# Altium schematic sheet PI_INTERFACE.SchDoc: Laser PCB
size A3; DrawnBy: James Singleton; Organization: TMC Technology Ltd.; DocumentNumber: 6; Revision: A; SheetNumber: 6; SheetTotal: 18; Drawn Date: 22/12/2020
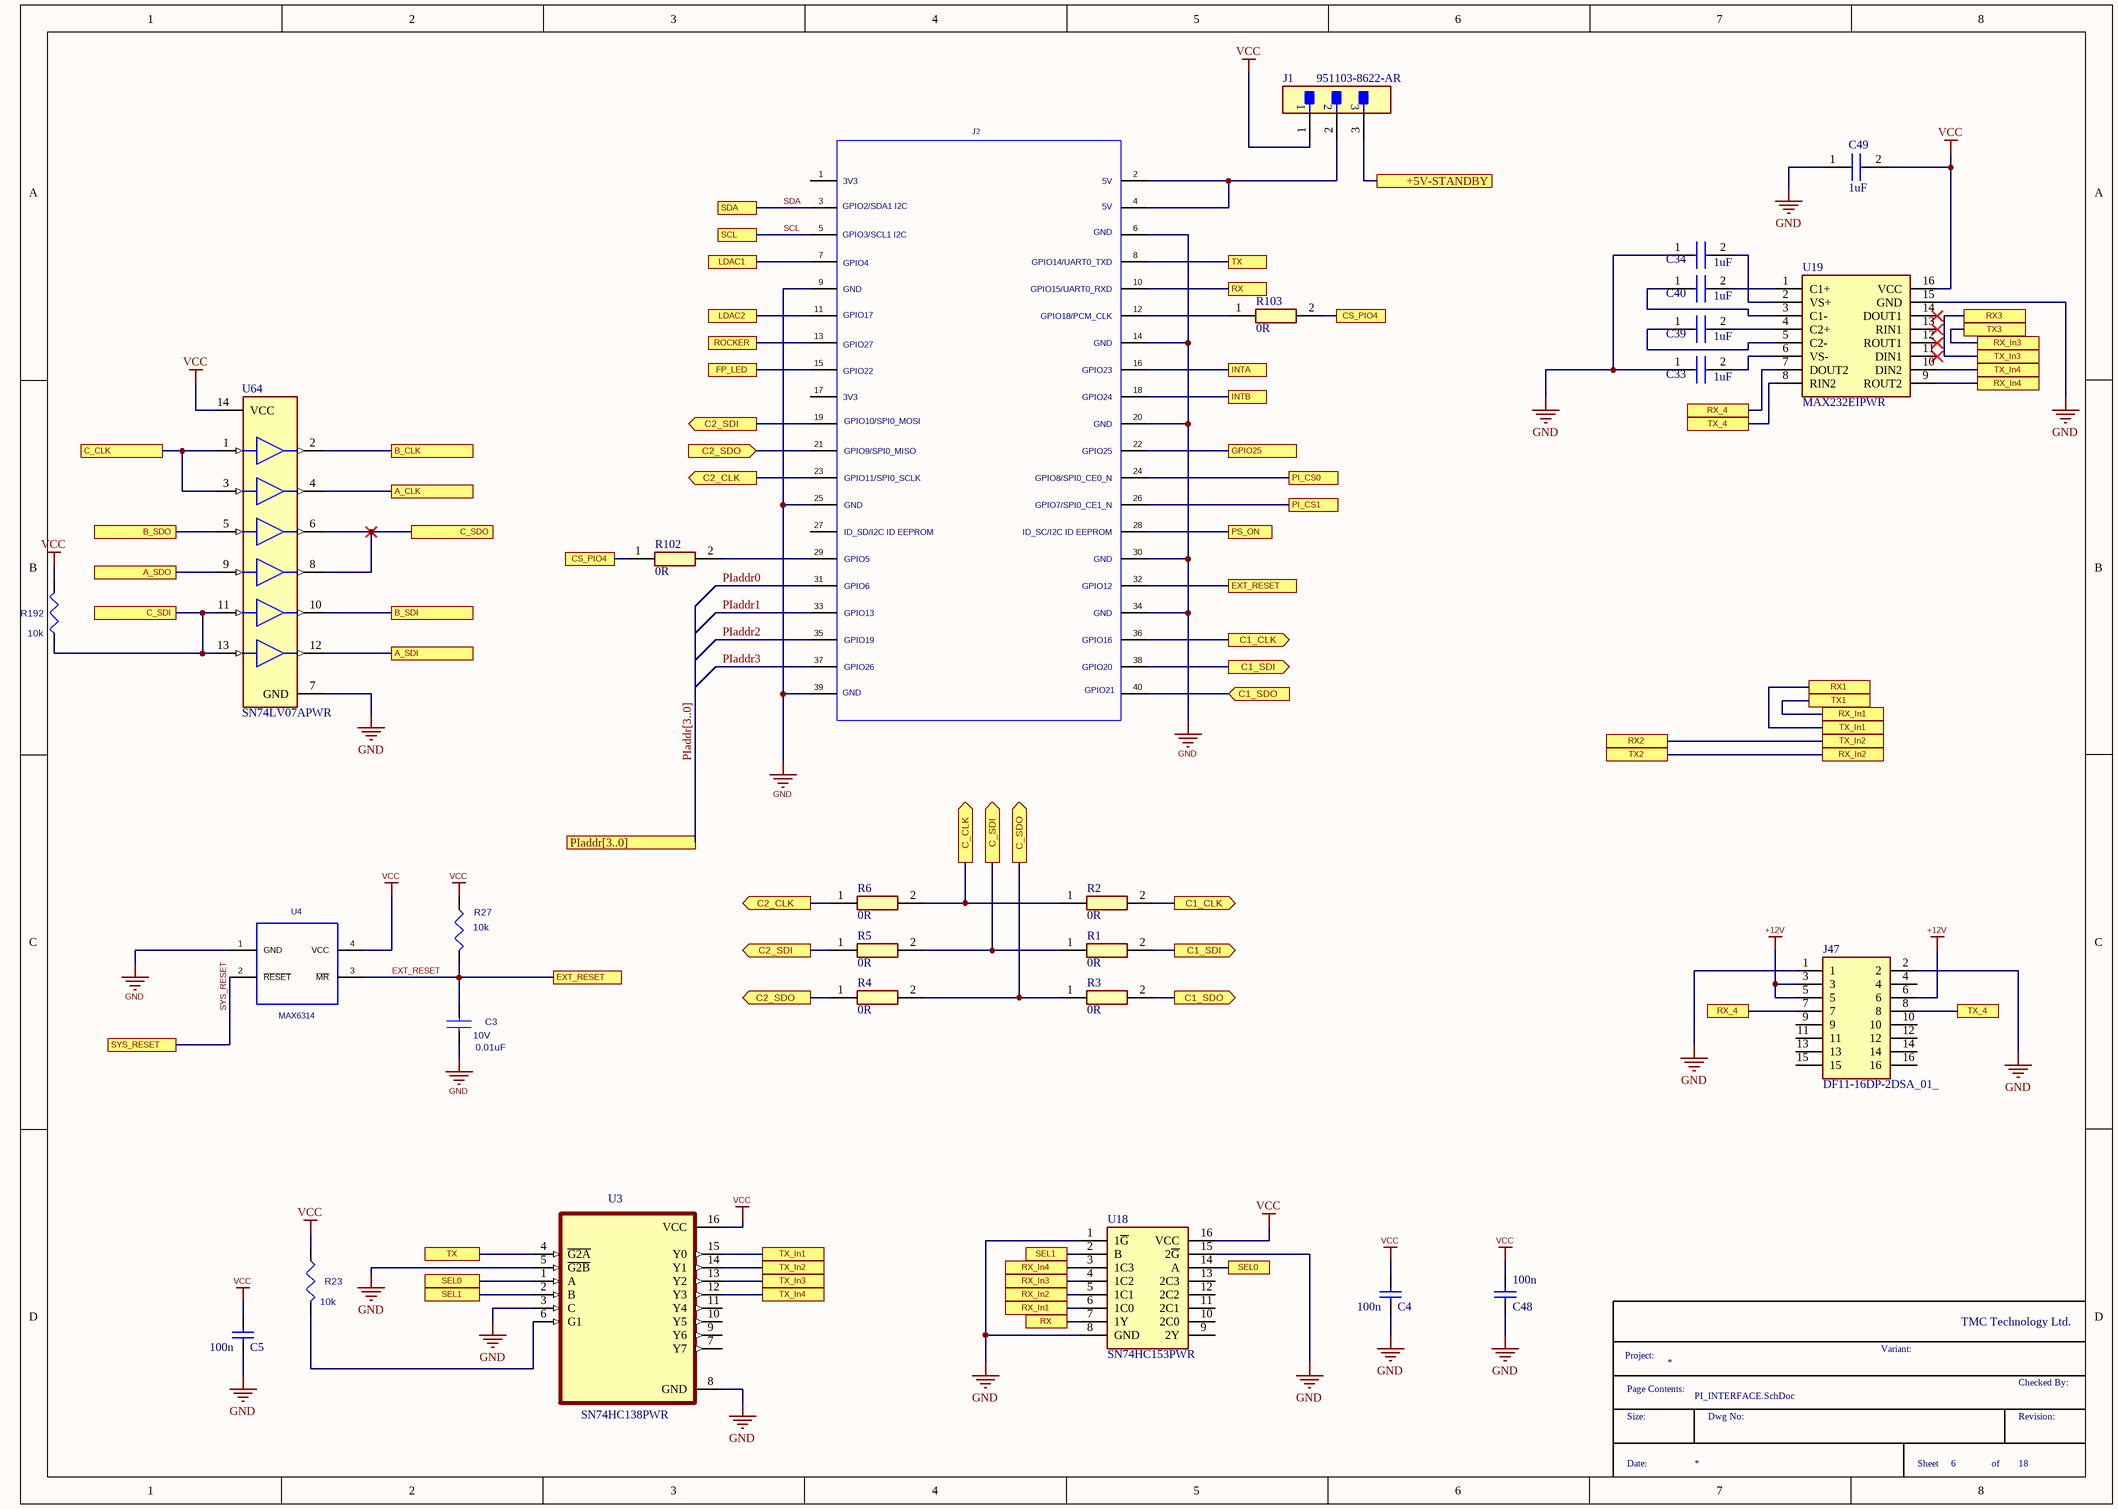
[diagram p0: PI_INTERFACE.SchDoc]

## Parts
C3  value 0.01uF  Rated_Voltage: 10V  [CC0603N]  (hidden comment: CAP)
C4  100n  [CAPC1608X90X35LL15T15]
C5  100n  [CAPC1608X90X35LL15T15]
C33  1uF  [CAPC1608X95N]
C34  1uF  [CAPC1608X95N]
C39  1uF  [CAPC1608X95N]
C40  1uF  [CAPC1608X95N]
C48  100n  [CAPC1608X90X35LL15T15]
C49  1uF  [CAPC1608X95N]
J1  951103-8622-AR  [FP-951103-8622-AR-MFG]
J2  RPI_PLUG  [HDRV40W64P254_2X20_5080X483X878P]  (value not drawn)
J47  DF11-16DP-2DSA_01_  [DF1116DP2DSA01]
R1  0R  [RESC1608X55N]
R2  0R  [RESC1608X55N]
R3  0R  [RESC1608X55N]
R4  0R  [RESC1608X55N]
R5  0R  [RESC1608X55N]
R6  0R  [RESC1608X55N]
R23  value 10k  [CR0603N]  (hidden comment: RES)
R27  value 10k  [CR0603N]  (hidden comment: RES)
R102  value 0R  [RESC1608X55N]  (hidden comment: RC0603FR-070RL)
R103  value 0R  [RESC1608X55N]  (hidden comment: RC0603FR-070RL)
R192  value 10k  [CR0603N]  (hidden comment: RES)
U3  SN74HC138PWR  [SOP65P640X120-16N]
U4  MAX6314  [SOT190P230X110-4N]
U18  SN74HC153PWR  [SOP65P640X120-16N]
U19  MAX232EIPWR  [SOP65P640X120-16N]
U64  SN74LV07APWR  [FP-PW0014A-IPC_B]

## Ports
+5V-STANDBY (see Power[6A]), A_CLK (see iDAC1[4A], iDAC2[4A], vDAC1[4A], vDAC2[4A]), A_SDI (see iDAC1[4A], iDAC2[4A], vDAC1[4A], vDAC2[4A]), A_SDO (see iDAC1[4A], iDAC2[4A], vDAC1[4A], vDAC2[4A]), B_CLK (see iDAC1[6A], iDAC2[6A], vDAC1[5A], vDAC2[5A]), B_SDI (see iDAC1[6A], iDAC2[6A], vDAC1[5A], vDAC2[5A]), B_SDO (see iDAC1[6A], iDAC2[6A], vDAC1[5A], vDAC2[5A]), C1_CLK (out, see PI_INTERFACE[5B]), C1_CLK (out, see PI_INTERFACE[5C]), C1_SDI (out, see PI_INTERFACE[5B]), C1_SDI (out, see PI_INTERFACE[5C]), C1_SDO (in, see PI_INTERFACE[5C]), C1_SDO (out, see PI_INTERFACE[5B]), C2_CLK (out, see PI_INTERFACE[3B]), C2_CLK (out, see PI_INTERFACE[3C]), C2_SDI (out, see PI_INTERFACE[3B]), C2_SDI (out, see PI_INTERFACE[3C]), C2_SDO (in, see PI_INTERFACE[3C]), C2_SDO (out, see PI_INTERFACE[3B]), C_CLK (out, see ChipSelects+Faults[4A], ChipSelects+Faults[4B], ChipSelects+Faults[4C], ChipSelects+Faults[4D], LIM+LEDS+POWER[8A], PI_INTERFACE[1B], PIO[3B], PIO[3D], PIO[6B], PIO[6C]), C_CLK (see ChipSelects+Faults[4A], ChipSelects+Faults[4B], ChipSelects+Faults[4C], ChipSelects+Faults[4D], LIM+LEDS+POWER[8A], PI_INTERFACE[4C], PIO[3B], PIO[3D], PIO[6B], PIO[6C]), C_SDI (out, see ChipSelects+Faults[4D], LIM+LEDS+POWER[8A], PI_INTERFACE[1B], PIO[3B], PIO[3D], PIO[6B], PIO[6C]), C_SDI (see ChipSelects+Faults[4D], LIM+LEDS+POWER[8A], PI_INTERFACE[4C], PIO[3B], PIO[3D], PIO[6B], PIO[6C]), C_SDO (out, see LIM+LEDS+POWER[6A], PI_INTERFACE[2B], PIO[3B], PIO[3D], PIO[6B], PIO[6C]), C_SDO (see LIM+LEDS+POWER[6A], PI_INTERFACE[4C], PIO[3B], PIO[3D], PIO[6B], PIO[6C]), CS_PIO4 (see PI_INTERFACE[3B], PIO[3D]), CS_PIO4 (see PI_INTERFACE[6A], PIO[3D]), EXT_RESET (see PI_INTERFACE[3C]), EXT_RESET (see PI_INTERFACE[5B]), FP_LED (see Fan & Power Out[7C]), GPIO25 (see Fan & Power Out[3D]), INTA (see PIO[5A], PIO[5D], PIO[7A], PIO[7C]), INTB (see PIO[5A], PIO[5D], PIO[7A], PIO[7C]), LDAC1 (see TEC_CONTROLLER_1[7A]), LDAC2 (see TEC_CONTROLLER_1[6B]), PI_CS0 (see ChipSelects+Faults[5B], ChipSelects+Faults[5C], ChipSelects+Faults[7A]), PI_CS1 (see ChipSelects+Faults[5A], ChipSelects+Faults[5C], ChipSelects+Faults[7A]), PIaddr[3..0] (see ChipSelects+Faults[4A], ChipSelects+Faults[4B], ChipSelects+Faults[4C], ChipSelects+Faults[7A]), PS_ON (see Power[7A]), ROCKER (see Fan & Power Out[2D]), RX1 (see PIO[1A]), RX2 (see PIO[1B]), RX3 (see PIO[1B]), RX (see PI_INTERFACE[4D]), RX (see PI_INTERFACE[5A]), RX_4 (see PI_INTERFACE[7B]), RX_4 (see PI_INTERFACE[7C]), RX_In1 (see PI_INTERFACE[4D]), RX_In1 (see PI_INTERFACE[7B]), RX_In2 (see PI_INTERFACE[4D]), RX_In2 (see PI_INTERFACE[7C]), RX_In3 (see PI_INTERFACE[4D]), RX_In3 (see PI_INTERFACE[8A]), RX_In4 (see PI_INTERFACE[4D]), RX_In4 (see PI_INTERFACE[8B]), SCL (see ADC-DAC[2C], ADC-DAC[3A], ADC-DAC[4B], ADC-DAC[4C], ADC-DAC[5C], ADC-DAC[6A], Fan & Power Out[6A], TEC_CONTROLLER_1[6B], TEC_CONTROLLER_1[7A], TEC_CONTROLLER_1[8B]), SDA (see ADC-DAC[2C], ADC-DAC[3A], ADC-DAC[4B], ADC-DAC[4C], ADC-DAC[5C], ADC-DAC[6A], Fan & Power Out[6A], TEC_CONTROLLER_1[6B], TEC_CONTROLLER_1[7A], TEC_CONTROLLER_1[7B]), SEL0 (see PI_INTERFACE[2D], PIO[5B]), SEL0 (see PI_INTERFACE[5D], PIO[5B]), SEL1 (see PI_INTERFACE[2D], PIO[5B]), SEL1 (see PI_INTERFACE[4D], PIO[5B]), SYS_RESET (see iDAC1[4A], iDAC1[6A], iDAC2[4A], iDAC2[6A], PIO[5A], PIO[5D], PIO[7B], PIO[7C], vDAC1[4A], vDAC1[5A], vDAC2[3A], vDAC2[5A]), TX1 (see PIO[2A]), TX2 (see PIO[2B]), TX3 (see PIO[2B]), TX (see PI_INTERFACE[2D]), TX (see PI_INTERFACE[5A]), TX_4 (see PI_INTERFACE[7B]), TX_4 (see PI_INTERFACE[8C]), TX_In1 (see PI_INTERFACE[3D]), TX_In1 (see PI_INTERFACE[7B]), TX_In2 (see PI_INTERFACE[3D]), TX_In2 (see PI_INTERFACE[7B]), TX_In3 (see PI_INTERFACE[3D]), TX_In3 (see PI_INTERFACE[8A]), TX_In4 (see PI_INTERFACE[3D]), TX_In4 (see PI_INTERFACE[8A])

## Nets
+12V: J47.3 J47.5 J47.6
GND: C3.2 C4.2 C5.2 C33.1 C34.1 C48.2 C49.1 J2.6 J2.9 J2.14 J2.20 J2.25 J2.30 J2.34 J2.39 J47.1 J47.2 U3.3(C) U3.5(~{G2B}) U3.8(GND) U4.1(GND) U18.1(1~{G}) U18.8(GND) U18.15(2~{G}) U19.15(GND) U64.7(GND)
VCC: C4.1 C5.1 C48.1 C49.2 J1.1 R23.1 R27.1 R192.1 U3.16(VCC) U4.4(VCC) U18.16(VCC) U19.16(VCC) U64.14(VCC)
+5V-STANDBY: J1.3 ; port +5V-STANDBY
A_CLK: U64.4(2Y) ; port A_CLK
A_SDI: U64.12(6Y) ; port A_SDI
A_SDO: U64.9(4A) ; port A_SDO
B_CLK: U64.2(1Y) ; port B_CLK
B_SDI: U64.10(5Y) ; port B_SDI
B_SDO: U64.5(3A) ; port B_SDO
C1_CLK: J2.36 R2.2 ; port C1_CLK
C1_SDI: J2.38 R1.2 ; port C1_SDI
C1_SDO: J2.40 R3.2 ; port C1_SDO
C2_CLK: J2.23 R6.1 ; port C2_CLK
C2_SDI: J2.19 R5.1 ; port C2_SDI
C2_SDO: J2.21 R4.1 ; port C2_SDO
C_CLK: R2.1 R6.2 U64.1(1A) U64.3(2A) ; port C_CLK
C_SDI: R1.1 R5.2 R192.2 U64.11(5A) U64.13(6A) ; port C_SDI
C_SDO: R3.1 R4.2 U64.6(3Y) U64.8(4Y) ; port C_SDO
CS_PIO4: R102.1 R103.2 ; port CS_PIO4
EXT_RESET: C3.1 J2.32 R27.2 U4.3(~{MR}) ; port EXT_RESET
FP_LED: J2.15 ; port FP_LED
GPIO25: J2.22 ; port GPIO25
INTA: J2.16 ; port INTA
INTB: J2.18 ; port INTB
LDAC1: J2.7 ; port LDAC1
LDAC2: J2.11 ; port LDAC2
PI_CS0: J2.24 ; port PI_CS0
PI_CS1: J2.26 ; port PI_CS1
PIaddr0: J2.31
PIaddr1: J2.33
PIaddr2: J2.35
PIaddr3: J2.37
PS_ON: J2.28 ; port PS_ON
ROCKER: J2.13 ; port ROCKER
RX: J2.10 U18.7(1Y) ; port RX
RX1: U3.15(Y0) ; port RX1, port TX_In1
RX2: U3.14(Y1) ; port TX_In2, port RX2
RX3: U3.13(Y2) ; port RX3, port TX_In3
RX_4: J47.7 U19.7(DOUT2) ; port RX_4
RX_In1: U18.6(1C0) ; port RX_In1, port TX1
RX_In2: U18.5(1C1) ; port RX_In2, port TX2
RX_In3: U18.4(1C2) ; port RX_In3, port TX3
RX_In4: U18.3(1C3) U19.9(ROUT2) ; port RX_In4
SCL: J2.5 ; port SCL
SDA: J2.3 ; port SDA
SEL0: U3.1(A) U18.14(A) ; port SEL0
SEL1: U3.2(B) U18.2(B) ; port SEL1
SYS_RESET: U4.2(~{RESET}) ; port SYS_RESET
TX: J2.8 U3.4(~{G2A}) ; port TX
TX_4: J47.8 U19.8(RIN2) ; port TX_4
TX_In4: U3.12(Y3) U19.10(DIN2) ; port TX_In4
NetC33_2: C33.2 U19.6(VS-)
NetC34_2: C34.2 U19.2(VS+)
NetC39_1: C39.1 U19.5(C2-)
NetC39_2: C39.2 U19.4(C2+)
NetC40_1: C40.1 U19.3(C1-)
NetC40_2: C40.2 U19.1(C1+)
NetJ1_2: J1.2 J2.2 J2.4
NetJ2_12: J2.12 R103.1
NetJ2_29: J2.29 R102.2
NetR23_2: R23.2 U3.6(G1)

Not connected (* = marked no-connect by the designer): J2 1 17 27; J47 4 9 10 11 12 13 14 15 16; U3 7(Y7) 9(Y6) 10(Y5) 11(Y4); U18 9(2Y) 10(2C0) 11(2C1) 12(2C2) 13(2C3); U19 11(DIN1)* 12(ROUT1)* 13(RIN1)* 14(DOUT1)*

## Buses and harness runs
bus PIaddr[3..0] = port PIaddr[3..0]

## Notes on the sheet
- TMC Technology Ltd.
- Page Contents:
- Project:
- Variant:
- Checked By:
- Size:
- Date:
- Dwg No:
- Sheet
- of
- Revision:
- (in symbol RPI_PLUG) 3V3; 5V; GPIO2/SDA1 I2C; GPIO3/SCL1 I2C; GND; GPIO4; GPIO14/UART0_TXD; GPIO15/UART0_RXD; GPIO17; GPIO18/PCM_CLK; GPIO27; GPIO22; GPIO23; GPIO24; GPIO10/SPI0_MOSI; GPIO9/SPI0_MISO; GPIO25; GPIO11/SPI0_SCLK; GPIO8/SPI0_CE0_N; GPIO7/SPI0_CE1_N; ID_SD/I2C ID EEPROM; ID_SC/I2C ID EEPROM; GPIO5; GPIO6; GPIO12; GPIO13; GPIO19; GPIO16; GPIO26; GPIO20; GPIO21

## Library data of the parts
C3 = CAP: CAP.,0.01uF,X5R,10V,10%,0603; Manufacturer_PN: 0603ZD103KAT2A; Manufacturer: AVX; CLASS: DISCRETE; FPLIST: CC0603N,CC0603L,CC0603M; Source_Path: \\MIL-NS1\CIP\SCHEMATIC_SYMBOLS\LTC_CAPACITOR.OLB; Geometry.Height: 37.40mil; Tolerance: 10%; Dielectric_Type: X5R; Package_Size: 0603; PCB DECAL: CC0603N
C4 C5 C48 = CMP-1035-02592-3: Chip Capacitor, 100 nF, +/- 10%, 50 V, -55 to 125 degC, 0603 (1608 Metric), RoHS, Tape and Reel; Manufacturer: KEMET; Manufacturer Part Number: C0603C104K5RACTU; Case\Package: 0603; Type (Capacitors): X7R; Capacitance: 100 nF; Voltage Rating: 50 V; Pins: 2; Max Operating Temperature: 125 degC; Min Operating Temperature: -55 degC; Case Code (Imperial): 0603; DatasheetVersion: 07/2016; Package Quantity: 4000; Length: 1.6 mm; REACH SVHC: No SVHC; Packaging: Tape and Reel; Case Code (Metric): 1608; Mounting Technology: Surface Mount; RoHSCompliant: true; Height: 0.9 mm; ComponentLink1URL: http://www.avx.com/; ComponentLink2URL: http://datasheets.avx.com/X7RDielectric.pdf; Mount: Surface Mount; ComponentLink2Description: Datasheet; Width: 0.81 mm; PackageReference: 0603; PackageDescription: 2-Pin Surface Mount Device, Body 1.6 x 0.81 mm; Radiation Hardening: No; ComponentLink1Description: Manufacturer URL; Voltage Rating (DC): 50 V; Tolerance: 10%; 8Vinv: *
C33 C34 C39 C40 C49 = CL10B105KB8NQNC: Capacitor; Manufacturer_Name: SAMSUNG; Datasheet Link: https://product.samsungsem.com/mlcc/CL10B105KB8NQN.do; Height: 0.95mm; Manufacturer_Part_Number: CL10B105KB8NQNC; Mouser Part Number: 187-CL10B105KB8NQNC; Mouser Price/Stock: https://www.mouser.co.uk/ProductDetail/Samsung-Electro-Mechanics/CL10B105KB8NQNC?qs=Jm2GQyTW%2FbjBq1uiSyA2AQ%3D%3D; Arrow Part Number: CL10B105KB8NQNC; Arrow Price/Stock: https://www.arrow.com/en/products/cl10b105kb8nqnc/samsung-electro-mechanics?region=europe
J1 = CMP-05379-000003-1: CONN HEADER VERT 3POS 2MM; Manufacturer: 3M; Conn Gender: Male; Current Rating: 2A; Number Of Contacts: 3; Conn Orientation: Straight; Height: 6.3mm; Digikey Description: CONN HEADER VERT 3POS 2MM; Device Class L3: unset; Category: Conn; Manufacturer Part Number: 951103-8622-AR; RoHS: TRUE; Contact Material: Gold,Nickel; ComponentLink2Description: Datasheet; Temperature Range Low: -55°C; Device Class L1: Connectors; Pitch: 2mm; Mouser Description: Header; PinStrip; CopperAlloy; HighTempThermoplastic; 3Cnts; 1A; RtAngle; 951Series; Octopart: https://octopart.com/951103-8622-ar-3m-14400669; Package: 951103-8622-AR; Lead Free: Yes; Device Class L2: Headers and Wire Housings; Temperature Range High: +125°C; ComponentLink2URL: http://multimedia.3m.com/mws/media/1400506O/3m-pin-strip-header-951-series-78-5100-2653-3.pdf; Automotive: No; Temperature: -55°C to +125°C; Number Of Rows: 1
J2 = RPI_PLUG: PCB Plug, Board-to-Board, 2.54 mm, 2 Rows, 40 Contacts, Through Hole Mount; Manufacturer: Multicomp; Part No: 2214S-40SG-85; PCB DECAL: RPI-RECEPTACLE-40; Order No: 2847248; System: Connector
J47 = DF11-16DP-2DSA_01_: Connector; Manufacturer_Name: Hirose; Manufacturer_Part_Number: DF11-16DP-2DSA(01); Datasheet Link: https://www.hirose.com/en/product/document?clcode=CL0543-0523-8-01&productname=DF11-16DP-2DSA(01)&series=DF11&documenttype=2DDrawing&lang=en&documentid=0000995343; Height: 7.1mm; Mouser Part Number: 798-DF11-16DP-2DSA01; Mouser Price/Stock: https://www.mouser.co.uk/ProductDetail/Hirose-Connector/DF11-16DP-2DSA01?qs=Ux3WWAnHpjAxqp0S3o8oHg%3D%3D; Arrow Part Number: DF11-16DP-2DSA(01); Arrow Price/Stock: https://www.arrow.com/en/products/df11-16dp-2dsa-01/hirose-electric
R1-R6 = RC0603FR-070RL: Resistor; Manufacturer_Name: YAGEO; Datasheet Link: https://componentsearchengine.com/Datasheets/2/RC0603FR-070RL.pdf; Height: 0.55mm; Manufacturer_Part_Number: RC0603FR-070RL; Mouser Part Number: 603-RC0603FR-070RL; Mouser Price/Stock: https://www.mouser.co.uk/ProductDetail/YAGEO/RC0603FR-070RL?qs=0yPvnVz5%2FmpDQv43TwvCfw%3D%3D; Arrow Part Number: RC0603FR-070RL; Arrow Price/Stock: https://www.arrow.com/en/products/rc0603fr-070rl/yageo?region=europe
R23 R27 R192 = RES: RES.,10k OHMS,1%,1/10W,0603; Manufacturer_PN: ERJ3EKF1002V; Manufacturer: PANASONIC; Part No: P10.0KHCT-ND; CLASS: DISCRETE; Temperature_Coefficient: 100ppm/C; FPLIST: CR0603N,CR0603L,CR0603M; Source_Path: \\MIL-NS1\CIP\SCHEMATIC_SYMBOLS\LTC_RESISTOR.OLB; Geometry.Height: 37.40mil; PCB DECAL: CR0603N; Rated_Power: 1/10W; Tolerance: 1%; Package_Size: 0603
R102 R103 = RC0603FR-070RL: Resistor; Manufacturer_Name: Yageo Group; Datasheet Link: http://www.yageo.com/documents/recent/PYu-RC0603_51_RoHS_L_v5.pdf; Height: 0.55mm; Manufacturer_Part_Number: RC0603FR-070RL; Mouser Part Number: 603-RC0603FR-070RL; Mouser Price/Stock: https://www.mouser.co.uk/ProductDetail/YAGEO/RC0603FR-070RL?qs=0yPvnVz5%2FmpDQv43TwvCfw%3D%3D; Arrow Part Number: RC0603FR-070RL; Arrow Price/Stock: https://www.arrow.com/en/products/rc0603fr-070rl/yageo?region=nac
U3 = SN74HC138PWR: 3-Line To 8-Line Decoders/Demultiplexers 16-TSSOP -40 to 85; MF: Texas Instruments; Purchase-URL: https://pricing.snapeda.com/search/part/SN74HC138PWR/?ref=eda; Package: TSSOP-16 Texas Instruments; MP: SN74HC138PWR; Value: *; SnapEDA_Link: https://www.snapeda.com/parts/SN74HC138PWR/Texas%20Instruments/view-part/387913/?ref=snap; Price: None; Availability: Unavailable; Check_prices: https://www.snapeda.com/parts/SN74HC138PWR/Texas%20Instruments/view-part/387913/?ref=eda
U4 = MAX6314: IC SUPERVISOR 1 CHANNEL SOT143-4; Manufacturer: Maxim; Part No: MAX6314US46D3+T; Geometry.Height: 1.1mm; Value: 4V63; Order No: 2512504; PCB DECAL: SOT190P230X110-4N
U18 = SN74HC153PWR: Integrated Circuit; Manufacturer_Name: Texas Instruments; Datasheet Link: http://www.ti.com/lit/gpn/sn74hc153; Height: 1.2mm; Manufacturer_Part_Number: SN74HC153PWR; Mouser Part Number: 595-SN74HC153PWR; Mouser Price/Stock: https://www.mouser.co.uk/ProductDetail/Texas-Instruments/SN74HC153PWR?qs=q81XD9WTF%252BI3umBBLdI3jQ%3D%3D; Arrow Part Number: SN74HC153PWR; Arrow Price/Stock: https://www.arrow.com/en/products/sn74hc153pwr/texas-instruments?region=nac
U19 = MAX232EIPWR: Integrated Circuit; Manufacturer_Name: Texas Instruments; Datasheet Link: http://www.ti.com/lit/gpn/max232e; Height: 1.2mm; Manufacturer_Part_Number: MAX232EIPWR; Mouser Part Number: 595-MAX232EIPWR; Mouser Price/Stock: https://www.mouser.co.uk/ProductDetail/Texas-Instruments/MAX232EIPWR?qs=iSMark9AYDUnm9LHXTJ2Sg%3D%3D; Arrow Part Number: MAX232EIPWR; Arrow Price/Stock: https://www.arrow.com/en/products/max232eipwr/texas-instruments?region=nac
U64 = CMP-0440-01103-4: IC BUF NON-INVERT 5.5V 14TSSOP; Logic Function: Buffer; Low Level Output Current: 16mA; Quiescent Current: 20uA; Propagation Delay: 7.5ns; Number of Channels: 6; Polarity: Non-Inverting; Turn-On Delay Time: 18ns; Number of Bits per Element: 1; High Level Output Current: -2uA; Min Supply Voltage: 2V; Height: 1.15mm; Width: 4.4mm; Contact Plating: Gold; Lead Free: Lead Free; Radiation Hardening: No; Technology: CMOS; Max Operating Temperature: 125°C; Packaging: Tape and Reel; Series: 74LV; Number of Output Lines: 6; RoHS Compliant: Yes; Number of Inputs: 6; Number of Gates: 6; Number of Outputs: 6; Mount: Surface Mount; Case/Package: TSSOP; Number of Bits: 6; Package Quantity: 2000; Max Supply Voltage: 5.5V; Number of Pins: 14; REACH SVHC: No SVHC; Number of Input Lines: 6; Number of Elements: 6; Min Operating Temperature: -40°C; Length: 5mm